# EAGLE design smile (EAGLE 7.2.0)
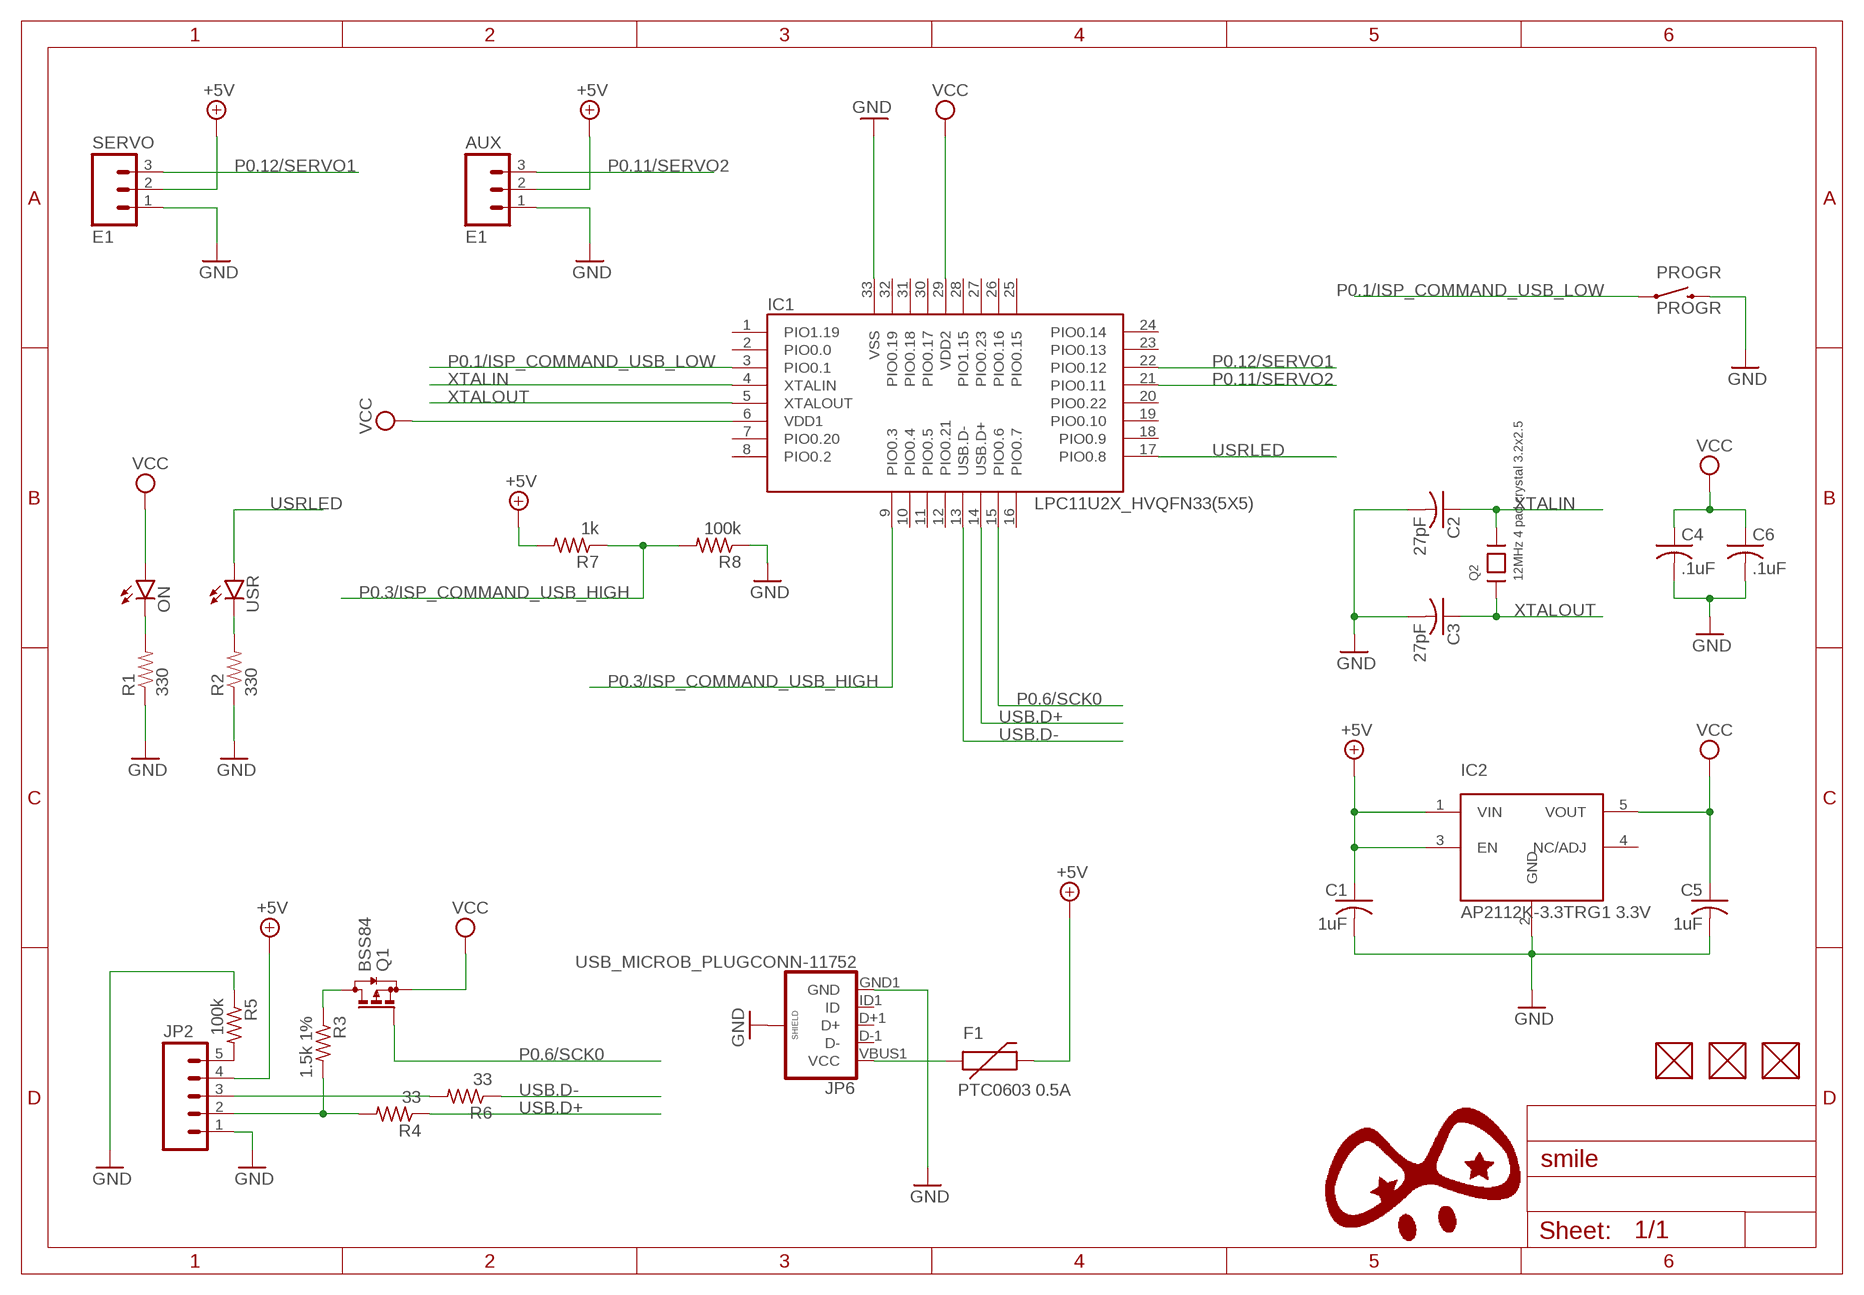
[diagram p0: schematic, sheet 1]

## Parts
AUX  E1  M031X03_NO_SILK  [1X03_NO_SILK]
C1  1uF  C-USC0603K  [C0603K]
C2  27pF  C-USC0402K  [C0402K]
C3  27pF  C-USC0402K  [C0402K]
C4  .1uF  C-USC0402K  [C0402K]
C5  1uF  C-USC0603K  [C0603K]
C6  .1uF  C-USC0402K  [C0402K]
F1  PTC0603 0.5A  PTC0603  [0603]
FUD1  FIDUCIAL  [FIDUCIAL_40MIL]
FUD2  FIDUCIAL  [FIDUCIAL_40MIL]
FUD3  FIDUCIAL  [FIDUCIAL_40MIL]
IC1  LPC11U2X_HVQFN33(5X5)  [HVQFN33_5X5MM]
IC2  AP2112K-3.3TRG1 3.3V  5PIN_REG  [SOT23-5]
JP2  M05LOCK  [1X05_LOCK]
JP6  USB_MICROB_PLUGCONN-11752  [USB-B-MICRO-SMD_V03]
ON  LED0603  [LED-0603]
PROGR  PROGR  SWITCH-MOMENTARY-2SIDE_EZ  [TACTILE-PTH-SIDEEZ]
Q1  BSS84  [SOT23]
Q2  12MHz 4 pad crystal 3.2x2.5  CRYSTAL3.2X2.5  [CRYSTAL_3.2X2.5]
R1  330  RESISTOR0402-RES  [0402-RES]
R2  330  RESISTOR0402-RES  [0402-RES]
R3  1.5k 1%  R-US_R0402  [R0402]
R4  33  R-US_R0402  [R0402]
R5  100k  R-US_R0402  [R0402]
R6  33  R-US_R0402  [R0402]
R7  1k  R-US_R0402  [R0402]
R8  100k  R-US_R0402  [R0402]
SERVO  E1  M031X03_NO_SILK  [1X03_NO_SILK]
USR  LED0603  [LED-0603]

## Nets
+5V: AUX.2 C1.1 F1.2 IC2.1(VIN) IC2.3(EN) JP2.4 R7.2 SERVO.2
GND: AUX.1 C1.2 C2.2 C3.2 C4.2 C5.2 C6.2 IC1.33(VSS) IC2.2(GND) JP2.1 JP6.GND1(GND) JP6.SHIELD1(SHIELD) JP6.SHIELD2(SHIELD) JP6.SHIELD3(SHIELD) PROGR.2 R1.1 R2.1 R5.1 R8.1 SERVO.1
N$1: JP2.3 R6.2
N$3: ON.C R1.2
N$4: JP2.2 R3.2 R4.2
N$5: Q1.3(D) R3.1
N$6: F1.1 JP6.VBUS1(VCC)
N$10: JP2.5 R5.2
N$22: R2.2 USR.C
P0.1/ISP_COMMAND_USB_LOW: IC1.3(PIO0.1) PROGR.1
P0.3/ISP_COMMAND_USB_HIGH: IC1.9(PIO0.3) R7.1 R8.2
P0.6/SCK0: IC1.15(PIO0.6) Q1.1(G)
P0.11/SERVO2: AUX.3 IC1.21(PIO0.11)
P0.12/SERVO1: IC1.22(PIO0.12) SERVO.3
USB.D+: IC1.14(USB.D+) R4.1
USB.D-: IC1.13(USB.D-) R6.1
USRLED: IC1.17(PIO0.8) USR.A
VCC: C4.1 C5.1 C6.1 IC1.6(VDD1) IC1.29(VDD2) IC2.5(VOUT) ON.A Q1.2(S)
XTALIN: C2.1 IC1.4(XTALIN) Q2.3
XTALOUT: C3.1 IC1.5(XTALOUT) Q2.1
Unconnected: FUD1.P$1 FUD2.P$1 FUD3.P$1 IC1.1(PIO1.19) IC1.2(PIO0.0) IC1.7(PIO0.20) IC1.8(PIO0.2) IC1.10(PIO0.4) IC1.11(PIO0.5) IC1.12(PIO0.21) IC1.16(PIO0.7) IC1.18(PIO0.9) IC1.19(PIO0.10) IC1.20(PIO0.22) IC1.23(PIO0.13) IC1.24(PIO0.14) IC1.25(PIO0.15) IC1.26(PIO0.16) IC1.27(PIO0.23) IC1.28(PIO1.15) IC1.30(PIO0.17) IC1.31(PIO0.18) IC1.32(PIO0.19) IC2.4(NC/ADJ) JP6.D+1(D+) JP6.D-1(D-) JP6.ID1(ID)

## Library data of the parts
AUX SERVO = SparkFun-Connectors:M03: Header 3 Standard 3-pin 0.1" header. Use with straight break away headers (SKU : PRT-00116), right angle break away headers (PRT-00553), swiss pins (PRT-00743), machine pins (PRT-00117), and female headers (PRT-00115). Molex polarized connector foot print use with SKU : PRT-08232 with associated crimp pins and housings.
C1-C6 = rcl:C-US: CAPACITOR, American symbol
F1 = SparkFun-PowerIC:PTC: Resettable Fuse PTC Resettable Fuse. Spark Fun Electronics SKU : COM-08357
FUD1-FUD3 = GHI:FIDUCIAL
IC1 = GHI-SoMs-Processors:LPC11U2X_HVQFN33(5X5)
IC2 = GHI:5PIN_REG
JP2 = SparkFun-Connectors:M05: Header 5 Standard 5-pin 0.1" header. Use with straight break away headers (SKU : PRT-00116), right angle break away headers (PRT-00553), swiss pins (PRT-00743), machine pins (PRT-00117), and female headers (PRT-00115). Molex polarized connector foot print use with SKU : PRT-08230 with associated crimp pins and housings.
JP6 = SparkFun-Connectors:USB_MICROB_PLUG: USB Micro-B connectors Some male, some female. Watch your step!; PROD_ID: CONN-11752
ON USR = SparkFun-LED:LED: LEDs Standard schematic elements and footprints for 5mm, 3mm, 1206, and 0603 sized LEDs. 5mm - Spark Fun Electronics SKU : COM-00529 (and others)
PROGR = SparkFun-Electromechanical:SWITCH-MOMENTARY-2: Various NO switches- pushbuttons, reed, etc
Q1 = transistor-small-signal:BSS84: P-CHANNEL MOS FET
Q2 = GHI:CRYSTAL3.2X2.5
R1 R2 = SparkFun-Passives:RESISTOR: Resistor Basic schematic elements and footprints for 0603, 1206, and PTH resistors.
R3-R8 = rcl:R-US_: RESISTOR, American symbol

## Net classes
0 default: width 0.254 mm, drill 0.254 mm, clearance 0.203 mm

## Board
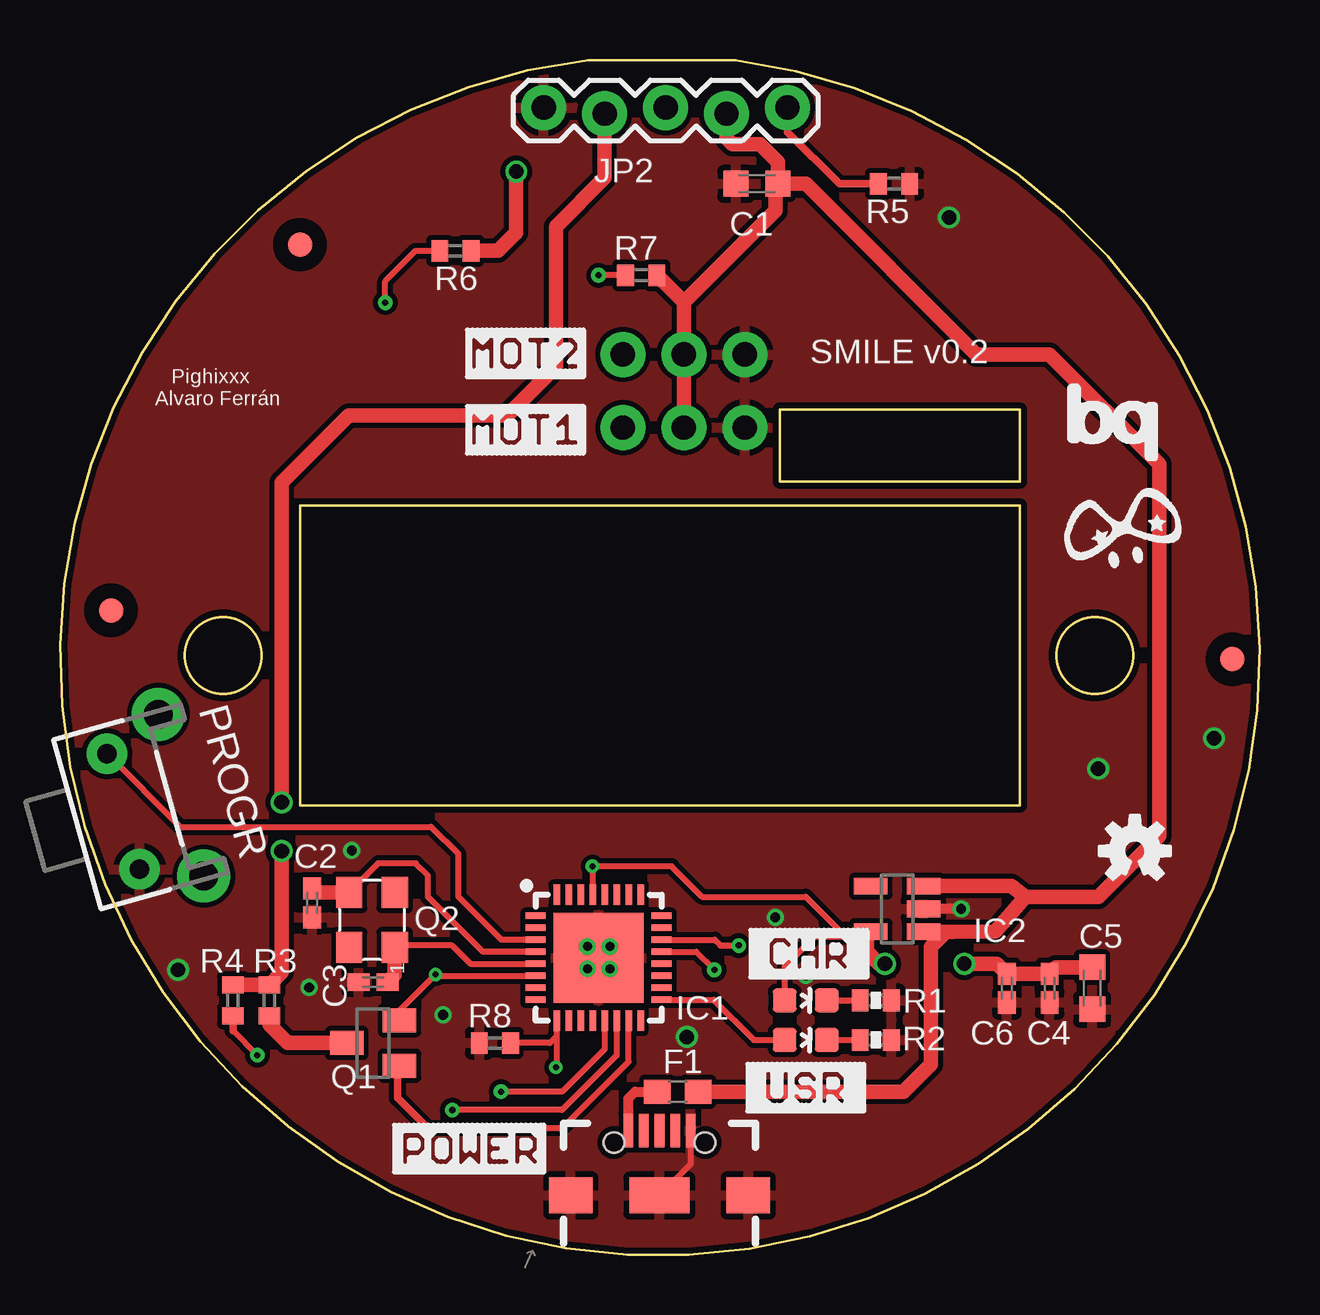
[diagram p1: board, top side]
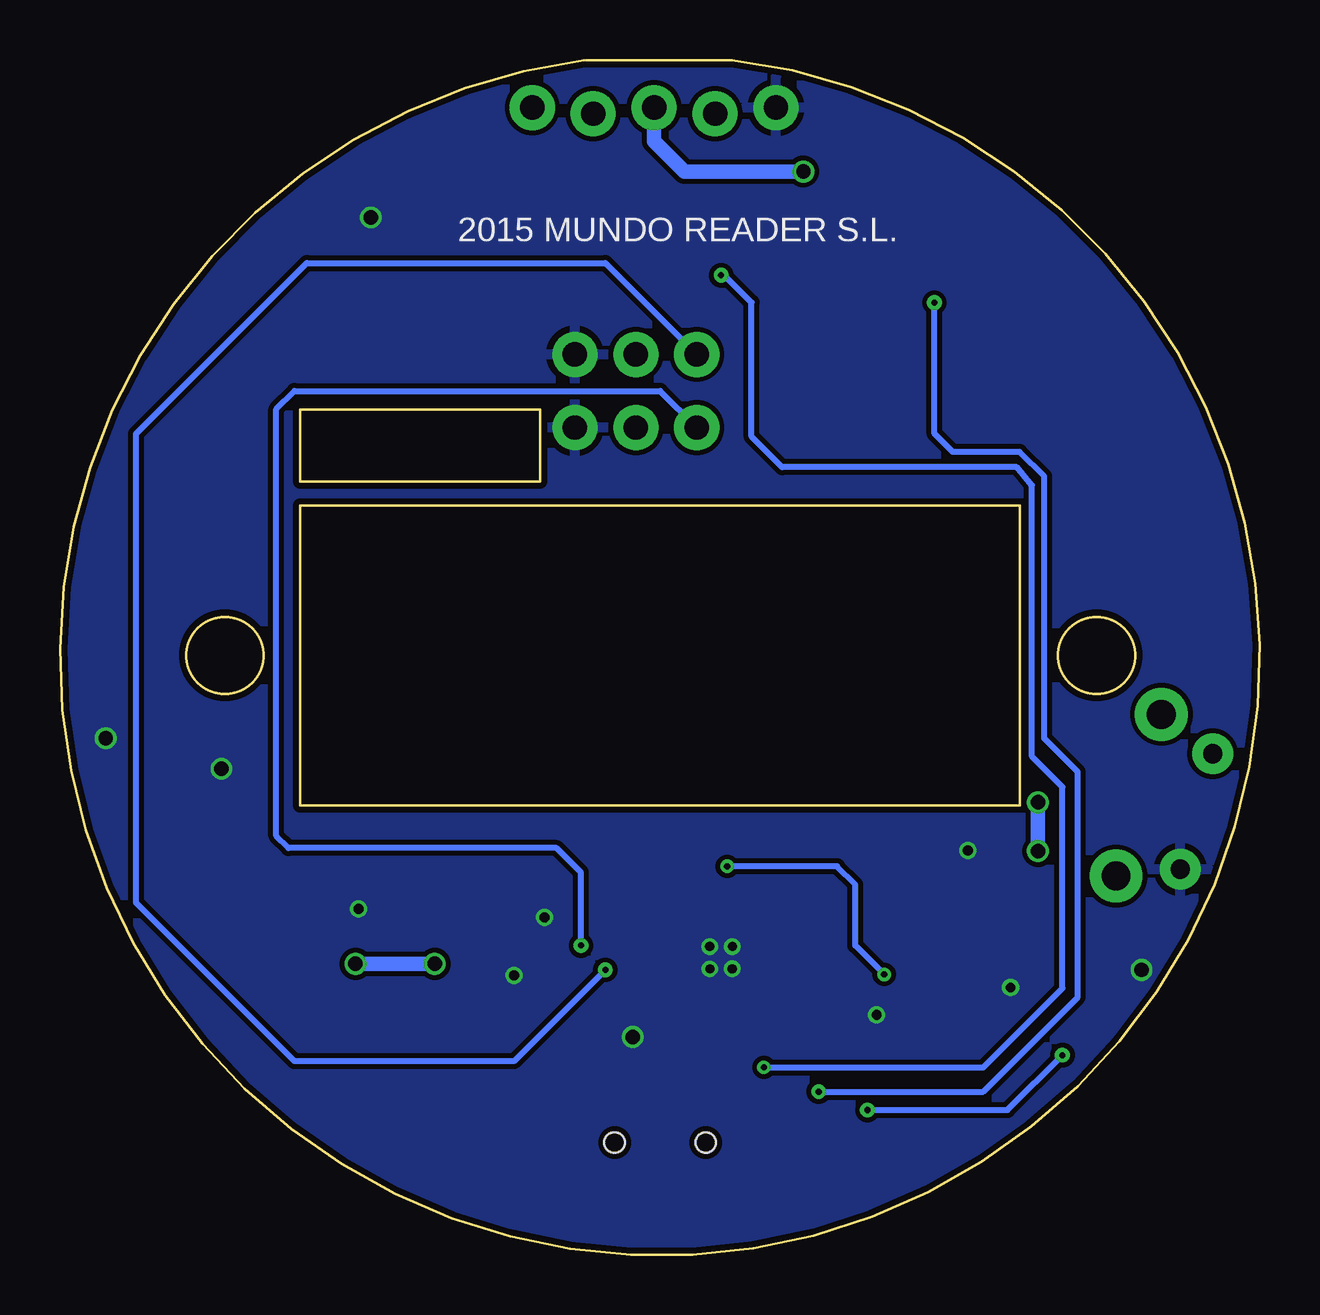
[diagram p2: board, bottom side, seen from below]

Size 50.01 x 49.81 mm. Coordinates in mm from the lower left corner, seen from the top.
Outline: 28.16,49.79 arc-346 22,49.81
Outline: 22.04,49.8 28.09,49.8
Outline: 10,18.74 40,18.74 40,31.24 10,31.24 10,18.74
Outline: 40,32.24 30,32.24 30,35.24 40,35.24 40,32.24
Outline: circle at 6.8,24.99 radius 1.6
Outline: circle at 43.13,24.99 radius 1.6
Copper layers (1*16): Top 0.035mm / dielectric 1.5mm / Bottom 0.035mm
Design rules "pighixxx_CAM_DRC_V1.0": minimum track width 6mil, minimum drill 12mil, track to track 6mil, track to pad 6mil, pad to pad 6mil, via to via 6mil, smd to smd 0mil, copper to edge 10mil, drill to drill 10mil, minimum pad ring 10mil, minimum via ring 6mil, stop-mask expansion 2mil, vias tented up to drill 100mil, thermal gap 10mil

### Footprints (pad centres in the part's own frame; a part is rotated, then mirrored left to right if it is on the bottom)
1X03_NO_SILK = drill 1.016 pad 1.88: 1 0,0; 2 2.54,0; 3 5.08,0
C0603K = smd 1.05 x 1.08: 1 -0.875,0; 2 0.875,0
C0402K = smd 0.925 x 0.74: 1 -0.6,0; 2 0.6,0
0603 = smd 1.1 x 1: 1 -0.85,0; 2 0.85,0
FIDUCIAL_40MIL = smd 1.016 x 1.016: P$1 0,0
HVQFN33_5X5MM = smd 0.85 x 0.27: 1 -2.625,1.75; 2 -2.625,1.25; 3 -2.625,0.75; 4 -2.625,0.25; 5 -2.625,-0.25; 6 -2.625,-0.75; 7 -2.625,-1.25; 8 -2.625,-1.75; 17 2.625,-1.75; 18 2.625,-1.25; 19 2.625,-0.75; 20 2.625,-0.25; 21 2.625,0.25; 22 2.625,0.75; 23 2.625,1.25; 24 2.625,1.75 | smd 0.27 x 0.85: 9 -1.75,-2.625; 10 -1.25,-2.625; 11 -0.75,-2.625; 12 -0.25,-2.625; 13 0.25,-2.625; 14 0.75,-2.625; 15 1.25,-2.625; 16 1.75,-2.625; 25 1.75,2.625; 26 1.25,2.625; 27 0.75,2.625; 28 0.25,2.625; 29 -0.25,2.625; 30 -0.75,2.625; 31 -1.25,2.625; 32 -1.75,2.625 | smd 3.75 x 3.75: 33 0,0
SOT23-5 = smd 0.7 x 1.4: 1 0.95,1.1; 2 0,1.1; 3 -0.95,1.1; 4 -0.95,-1.1; 5 0.95,-1.1
1X05_LOCK = drill 1.016 pad 1.88: 1 0,0.127; 2 2.54,-0.127; 3 5.08,0.127; 4 7.62,-0.127; 5 10.16,0.127
USB-B-MICRO-SMD_V03 = smd 1.4 x 0.4: D+1 2.7,0; D-1 2.7,0.65; GND1 2.7,-1.3; ID1 2.7,-0.65; VBUS1 2.7,1.3 | smd 1.5 x 1.8: SHIELD1 0,3.7; SHIELD2 0,-3.7 | smd 1.5 x 2.5: SHIELD3 0,0 | hole 0.85: 2.2,1.9; 2.2,-1.9
LED-0603 = smd 1 x 1: A 0,-0.877; C 0,0.877
TACTILE-PTH-SIDEEZ = drill 0.8 pad 1.7: 1 -2.5,0; 2 2.5,0 | drill 1.2 pad 2.2: ANCHOR1 -3.5,2.5; ANCHOR2 3.5,2.5
SOT23 = smd 1 x 1.4: 1 -0.95,-1.1; 2 0.95,-1.1; 3 0,1.1
CRYSTAL_3.2X2.5 = smd 1.3 x 1.1: 1 -1.1,-0.9; 2 1.2,-0.9; 3 1.2,1; 4 -1.1,1
0402-RES = smd 0.7 x 0.9: 1 -0.65,0; 2 0.65,0
R0402 = smd 0.7 x 0.9: 1 -0.65,0; 2 0.65,0

### Placement (x,y rotation side)
AUX  28.55,37.53 180 top
C1  29.05,44.64 180 top
C2  10.51,14.67 270 top
C3  13.05,11.37 180 top
C4  41.25,11.12 270 top
C5  43.02,11.12 270 top
C6  39.47,11.12 270 top
F1  25.75,6.8 0 top
FUD1  10,42.1 0 top
FUD2  48.87,24.83 0 top
FUD3  2.13,26.86 0 top
IC1  22.45,12.39 0 top
IC2  34.9,14.42 270 top
JP2  20.16,47.69 0 top
JP6  24.99,2.48 90 top
ON  31.09,10.61 270 top
PROGR  2.64,18.48 285.7 top
Q1  13.05,8.83 90 top
Q2  13.05,13.91 90 top
R1  34.01,10.61 180 top
R2  34.01,8.96 180 top
R3  8.73,10.61 90 top
R4  7.21,10.61 90 top
R5  34.77,44.64 180 top
R6  16.48,41.85 0 top
R7  24.23,40.83 0 top
R8  18.13,8.83 0 top
SERVO  28.55,34.48 180 top
U$1  [OSHW-LOGO-S]  44.8,16.83 0 top
U$2  [SYM_PIGHIXXX]  41.88,28.64 0 top
U$3  [BQ_LOGO_MEDIUM]  42.01,33.09 0 top
U$4  [S_MOT1]  16.99,35.37 270 top
U$5  [S_MOT2]  16.99,38.55 270 top
U$6  [S_USR]  28.67,7.94 270 top
U$7  [S_CHR]  28.8,13.53 270 top
U$8  [S_POWER]  13.94,5.4 270 top
USR  31.09,8.96 270 top

### Tracks (layer width: path | path; a pad name or v marks a point on that pad's centre or on a via)
+5V
  Top 0.406: 35.91,13.38 IC2.1
  Top 0.61: IC2.1 36.93,13.47 | 36.93,13.47 37.25,13.47 38.98,13.48 40.23,14.93 | 40.23,14.93 39.66,15.37 IC2.3 | 40.23,14.93 43.28,14.93 45.82,17.47 45.82,32.96 41.25,37.53 38.2,37.53 31.09,44.64 C1.1 | C1.1 29.82,44.53 29.82,43.52 26.01,39.71 | SERVO.2 AUX.2 26.01,39.71 | 26.01,39.71 R7.2 | F1.2 35.15,6.8 36.29,7.94 36.29,12.83 36.93,13.47 | C1.1 29.93,45.55 29.18,46.3 28.04,46.3 27.78,46.55 JP2.4
GND  (via drill 0.38 pad 0.6, 0.41, 0.6 pad 0.61)
  Top 0.254: JP6.GND1 26.29,3.78 JP6.SHIELD3
  Top 0.406: v37.56,14.42 35.91,14.42
  other vias: 21.98,12.85 22.92,12.86 22.92,11.92 21.99,11.92 43.28,20.26 48.1,21.53 4.92,11.88 26.13,9.08 37.05,43.25 10.38,11.14 15.97,10 31.09,11.65 29.82,14.06 12.16,16.86
  pour Bottom: -3.46,50.74 -3.59,-1.33 53.56,-1.33 53.69,50.99 -1.55,50.99
  pour Top: -1.43,50.87 -1.55,-1.33 52.8,-1.33 52.93,51.38 0.86,51.38
N$1  (via drill 0.6 pad 0.61)
  Top 0.61: v19.02,45.15 19.02,42.61 18.26,41.85 R6.2
  Bottom 0.61: v19.02,45.15 23.97,45.15 25.24,46.42 JP2.3
N$3
  Top 0.254: ON.C R1.2
N$4  (via drill 0.61)
  Top 0.61: R4.2 R3.2 9.24,11.77 v9.24,16.83 | v9.24,18.86 9.24,32.2 12.04,34.99 18.64,34.99 20.67,37.02 20.67,42.87 22.7,44.9 JP2.2
  Bottom 0.61: v9.24,16.83 v9.24,18.86
N$5
  Top 0.61: R3.1 8.73,9.59 9.5,8.83 Q1.3
N$6
  Top 0.406: JP6.VBUS1 23.69,6.51 23.97,6.8 F1.1
N$10
  Top 0.254: 34.13,44.66 R5.2
  Top 0.305: JP2.5 30.32,46.8 32.48,44.64 R5.2
N$22
  Top 0.254: USR.C R2.2
P0.1/ISP_COMMAND_USB_LOW
  Top 0.254: IC1.3 18.4,13.14 16.61,14.93 16.61,16.7 15.46,17.85 5,17.85 PROGR.1
P0.3/ISP_COMMAND_USB_HIGH  (via drill 0.25, 0.25 pad 0.61)
  Top 0.254: R8.2 20.42,8.83 20.7,9.11 IC1.9 20.7,7.84 | R7.1 v22.45,40.83
  Top 0.305: 20.7,7.84 v20.67,7.81
  Bottom 0.254: v20.67,7.81 11.53,7.81 8.23,11.12 8.23,19.5 9.5,20.77 9.5,32.07 10.13,32.83 19.91,32.83 21.18,34.1 21.18,39.69 22.32,40.83 v22.45,40.83
P0.6/SCK0
  Top 0.254: IC1.15 23.7,8.05 20.93,5.27 15.34,5.27
  Top 0.305: 15.34,5.27 14.07,6.54 14.07,7.8 Q1.1
P0.11/SERVO2  (via drill 0.25 pad 0.61)
  Top 0.254: IC1.21 26.52,12.64 v27.28,11.88
  Bottom 0.254: v27.28,11.88 31.09,8.07 40.23,8.07 46.83,14.67 46.83,34.23 39.72,41.34 27.28,41.34 AUX.3
P0.12/SERVO1  (via drill 0.25 pad 0.61)
  Top 0.254: IC1.22 27.29,13.14 27.53,12.89 v28.29,12.89
  Bottom 0.254: v28.29,12.89 28.29,15.94 29.31,16.96 40.48,16.96 40.99,17.47 40.99,35.25 40.23,36.01 24.99,36.01 SERVO.3
USB.D+  (via drill 0.25 pad 0.61)
  Top 0.254: IC1.14 23.2,8.31 20.93,6.04 v16.35,6.04 | v8.23,8.32 7.21,9.34
  Top 0.305: 7.21,9.34 R4.1
  Bottom 0.254: v16.35,6.04 10.51,6.04 v8.23,8.32
USB.D-  (via drill 0.25 pad 0.61)
  Top 0.254: IC1.13 22.7,8.57 20.93,6.8 v18.39,6.8 | v13.56,39.69 13.56,40.58 14.83,41.85 R6.1
  Bottom 0.254: v18.39,6.8 11.53,6.8 7.59,10.74 7.59,20.13 8.99,21.53 8.99,32.45 10,33.47 12.8,33.47 13.56,34.23 v13.56,39.69
USRLED
  Top 0.254: IC1.17 27.25,10.64 28.93,8.96 USR.A
VCC  (via drill 0.25, 0.61)
  Top 0.254: v22.2,16.19 IC1.29 | v22.2,16.2 25.5,16.2 26.77,14.93 31.09,14.93 32.54,13.47 IC2.5 33.6,13.28 31.47,13.28 30.21,12.02 ON.A | Q1.2 14.15,10.18 v15.65,11.69 15.71,11.64 IC1.6
  Top 0.406: v22.2,16.2 v22.2,16.19 | C4.1 41.52,11.99 | 33.63,13.3 IC2.5
  Top 0.61: C4.1 C6.1 39.05,12.13 v37.69,12.13 | 41.52,11.99 C5.1 | v34.39,12.13 34.13,12.13 33.63,12.64 33.63,13.3
  Bottom 0.254: v22.2,16.2 17.62,16.2 16.86,15.43 16.86,12.89 v15.65,11.69
  Bottom 0.61: v37.69,12.13 v34.39,12.13
XTALIN
  Top 0.254: Q2.3 13.26,16.32 14.83,16.32 15.34,15.82 15.34,14.93 17.62,12.64 IC1.4
  Top 0.406: 12.04,15.13 Q2.3 | C2.1 10.67,15.11
  Top 0.61: 10.67,15.11 Q2.3
XTALOUT
  Top 0.254: IC1.5 17.11,12.14 16.35,12.89 14.04,12.89
  Top 0.305: 14.04,12.89 Q2.1
  Top 0.406: Q2.1 14.12,12.64
  Top 0.61: C3.1 13.95,11.67 Q2.1

### Text on the board
tNames: SMILE v0.2 | Pighixxx / Alvaro Ferrán
bNames: 2015 MUNDO READER S.L.